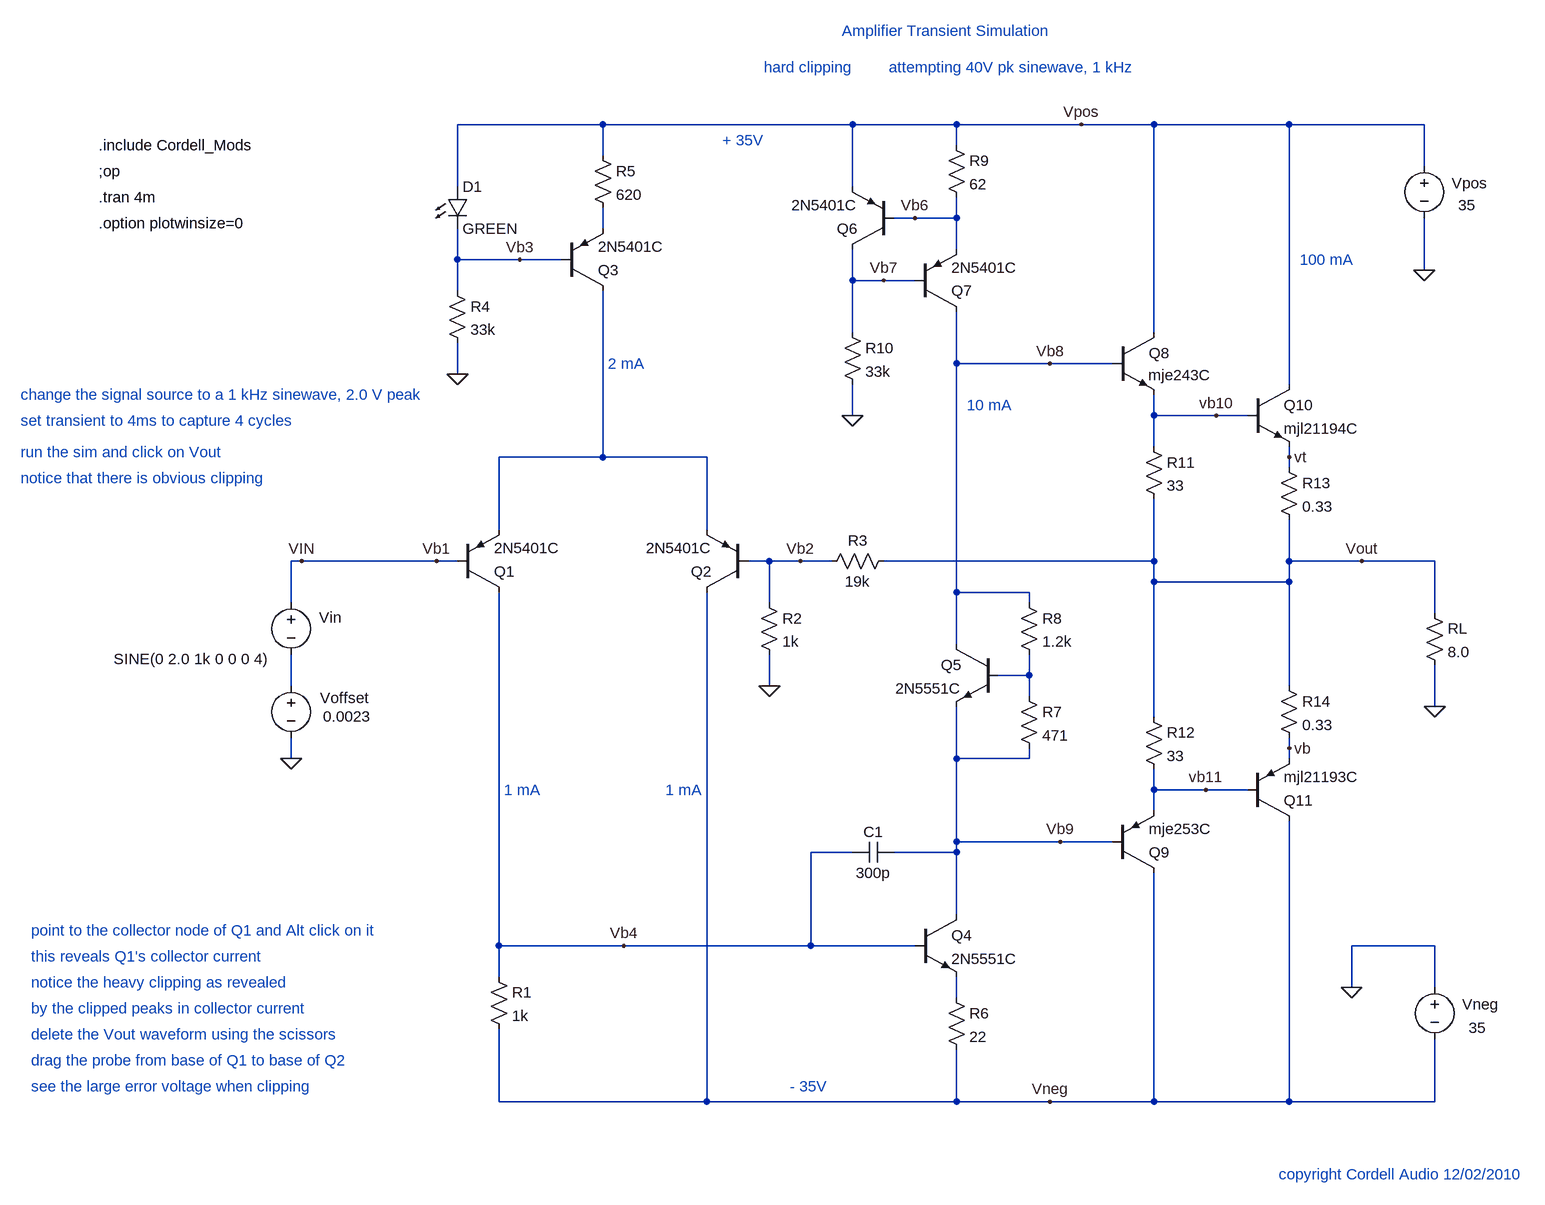
[diagram p0: schematic Amplifier Transient 1k clip plus.asc]
Amplifier Transient 1k clip plus.asc, the LTspice schematic file:
Version 4
SHEET 1 2428 1408
WIRE -128 -224 -352 -224
WIRE 256 -224 -128 -224
WIRE 416 -224 256 -224
WIRE 608 -224 416 -224
WIRE 720 -224 608 -224
WIRE 928 -224 720 -224
WIRE 1136 -224 928 -224
WIRE 416 -192 416 -224
WIRE -128 -176 -128 -224
WIRE 1136 -160 1136 -224
WIRE -352 -128 -352 -224
WIRE 256 -128 256 -224
WIRE 352 -80 320 -80
WIRE 416 -80 416 -112
WIRE 416 -80 352 -80
WIRE -128 -64 -128 -96
WIRE 416 -32 416 -80
WIRE -352 -16 -352 -64
WIRE -256 -16 -352 -16
WIRE -192 -16 -256 -16
WIRE 1136 0 1136 -80
WIRE 256 16 256 -32
WIRE 304 16 256 16
WIRE 352 16 304 16
WIRE -352 32 -352 -16
WIRE 256 96 256 16
WIRE 720 96 720 -224
WIRE 416 144 416 64
WIRE 560 144 416 144
WIRE 656 144 560 144
WIRE -352 160 -352 112
WIRE 928 176 928 -224
WIRE 256 224 256 176
WIRE 720 224 720 192
WIRE 816 224 720 224
WIRE 864 224 816 224
WIRE 720 272 720 224
WIRE -128 288 -128 32
WIRE -128 288 -288 288
WIRE 32 288 -128 288
WIRE 928 288 928 272
WIRE 928 304 928 288
WIRE -288 400 -288 288
WIRE 32 400 32 288
WIRE -592 448 -608 448
WIRE -384 448 -592 448
WIRE -352 448 -384 448
WIRE 128 448 96 448
WIRE 176 448 128 448
WIRE 224 448 176 448
WIRE 720 448 720 352
WIRE 720 448 304 448
WIRE 928 448 928 384
WIRE 1040 448 928 448
WIRE 1152 448 1040 448
WIRE 720 480 720 448
WIRE 928 480 928 448
WIRE 928 480 720 480
WIRE 416 496 416 144
WIRE 528 496 416 496
WIRE -608 512 -608 448
WIRE 128 512 128 448
WIRE 528 512 528 496
WIRE 1152 528 1152 448
WIRE 416 576 416 496
WIRE 528 624 528 592
WIRE 528 624 480 624
WIRE -608 640 -608 592
WIRE 128 640 128 592
WIRE 928 640 928 480
WIRE 528 656 528 624
WIRE 1152 672 1152 608
WIRE 720 688 720 480
WIRE 928 736 928 720
WIRE -608 752 -608 720
WIRE 416 752 416 672
WIRE 528 752 528 736
WIRE 528 752 416 752
WIRE 928 752 928 736
WIRE 720 800 720 768
WIRE 800 800 720 800
WIRE 864 800 800 800
WIRE 720 832 720 800
WIRE 416 880 416 752
WIRE 576 880 416 880
WIRE 656 880 576 880
WIRE 256 896 192 896
WIRE 416 896 416 880
WIRE 416 896 320 896
WIRE 416 992 416 896
WIRE -288 1040 -288 496
WIRE -96 1040 -288 1040
WIRE 192 1040 192 896
WIRE 192 1040 -96 1040
WIRE 352 1040 192 1040
WIRE 1152 1040 1024 1040
WIRE -288 1088 -288 1040
WIRE 1024 1104 1024 1040
WIRE 1152 1104 1152 1040
WIRE 416 1120 416 1088
WIRE -288 1280 -288 1168
WIRE 32 1280 32 496
WIRE 32 1280 -288 1280
WIRE 416 1280 416 1200
WIRE 416 1280 32 1280
WIRE 560 1280 416 1280
WIRE 720 1280 720 928
WIRE 720 1280 560 1280
WIRE 928 1280 928 848
WIRE 928 1280 720 1280
WIRE 1152 1280 1152 1184
WIRE 1152 1280 928 1280
FLAG -608 752 0
FLAG -592 448 VIN
FLAG -352 160 0
FLAG 128 640 0
FLAG 1024 1104 0
FLAG 1136 0 0
FLAG 928 288 vt
FLAG 928 736 vb
FLAG 816 224 vb10
FLAG 800 800 vb11
FLAG 256 224 0
FLAG 1152 672 0
FLAG 560 144 Vb8
FLAG 576 880 Vb9
FLAG -384 448 Vb1
FLAG 176 448 Vb2
FLAG -256 -16 Vb3
FLAG -96 1040 Vb4
FLAG 352 -80 Vb6
FLAG 304 16 Vb7
FLAG 1040 448 Vout
FLAG 608 -224 Vpos
FLAG 560 1280 Vneg
SYMBOL pnp -192 32 M180
SYMATTR InstName Q3
SYMATTR Value 2N5401C
SYMBOL pnp 320 -32 R180
SYMATTR InstName Q6
SYMATTR Value 2N5401C
SYMBOL voltage -608 496 R0
WINDOW 123 42 73 Left 0
WINDOW 39 0 0 Left 0
WINDOW 3 -273 103 Left 0
WINDOW 0 43 39 Left 0
SYMATTR Value SINE(0 2.0 1k 0 0 0 4)
SYMATTR InstName Vin
SYMBOL cap 320 880 R90
WINDOW 0 0 32 VBottom 0
WINDOW 3 32 32 VTop 0
SYMATTR InstName C1
SYMATTR Value 300p
SYMBOL npn 352 992 R0
SYMATTR InstName Q4
SYMATTR Value 2N5551C
SYMBOL res 400 -208 R0
SYMATTR InstName R9
SYMATTR Value 62
SYMBOL pnp 352 64 M180
SYMATTR InstName Q7
SYMATTR Value 2N5401C
SYMBOL res 400 1104 R0
SYMATTR InstName R6
SYMATTR Value 22
SYMBOL res -304 1072 R0
SYMATTR InstName R1
SYMATTR Value 1k
SYMBOL pnp -352 496 M180
SYMATTR InstName Q1
SYMATTR Value 2N5401C
SYMBOL pnp 96 496 R180
SYMATTR InstName Q2
SYMATTR Value 2N5401C
SYMBOL res -144 -192 R0
SYMATTR InstName R5
SYMATTR Value 620
SYMBOL res -368 16 R0
SYMATTR InstName R4
SYMATTR Value 33k
SYMBOL voltage 1136 -176 R0
WINDOW 123 0 0 Left 0
WINDOW 39 0 0 Left 0
WINDOW 0 42 42 Left 0
WINDOW 3 52 76 Left 0
SYMATTR InstName Vpos
SYMATTR Value 35
SYMBOL res 320 432 R90
WINDOW 0 0 56 VBottom 0
WINDOW 3 32 56 VTop 0
SYMATTR InstName R3
SYMATTR Value 19k
SYMBOL voltage 1152 1088 R0
WINDOW 123 0 0 Left 0
WINDOW 39 0 0 Left 0
WINDOW 0 42 42 Left 0
WINDOW 3 52 78 Left 0
SYMATTR InstName Vneg
SYMATTR Value 35
SYMBOL res 112 496 R0
SYMATTR InstName R2
SYMATTR Value 1k
SYMBOL npn 656 96 R0
WINDOW 3 55 66 Left 0
SYMATTR Value mje243C
SYMATTR InstName Q8
SYMBOL pnp 656 928 M180
SYMATTR InstName Q9
SYMATTR Value mje253C
SYMBOL res 912 624 R0
SYMATTR InstName R14
SYMATTR Value 0.33
SYMBOL res 912 288 R0
SYMATTR InstName R13
SYMATTR Value 0.33
SYMBOL npn 864 176 R0
SYMATTR InstName Q10
SYMATTR Value mjl21194C
SYMBOL pnp 864 848 M180
SYMATTR InstName Q11
SYMATTR Value mjl21193C
SYMBOL res 704 672 R0
SYMATTR InstName R12
SYMATTR Value 33
SYMBOL LED -368 -128 R0
SYMATTR InstName D1
SYMATTR Value GREEN
SYMBOL res 240 80 R0
SYMATTR InstName R10
SYMATTR Value 33k
SYMBOL res 1136 512 R0
SYMATTR InstName RL
SYMATTR Value 8.0
SYMBOL res 704 256 R0
SYMATTR InstName R11
SYMATTR Value 33
SYMBOL voltage -608 624 R0
WINDOW 123 0 0 Left 0
WINDOW 39 0 0 Left 0
WINDOW 0 45 35 Left 0
WINDOW 3 49 63 Left 0
SYMATTR InstName Voffset
SYMATTR Value 0.0023
SYMBOL npn 480 576 M0
SYMATTR InstName Q5
SYMATTR Value 2N5551C
SYMBOL res 512 496 R0
SYMATTR InstName R8
SYMATTR Value 1.2k
SYMBOL res 512 640 R0
SYMATTR InstName R7
SYMATTR Value 471
TEXT -904 -152 Left 0 !;op
TEXT -120 144 Left 0 ;2 mA
TEXT -280 800 Left 0 ;1 mA
TEXT 432 208 Left 0 ;10 mA
TEXT 56 -200 Left 0 ;+ 35V
TEXT 160 1256 Left 0 ;- 35V
TEXT -32 800 Left 0 ;1 mA
TEXT -904 -112 Left 0 !.tran 4m
TEXT -904 -72 Left 0 !.option plotwinsize=0
TEXT 944 -16 Left 0 ;100 mA
TEXT 312 -312 Left 0 ;attempting 40V pk sinewave, 1 kHz
TEXT -1024 192 Left 0 ;change the signal source to a 1 kHz sinewave, 2.0 V peak
TEXT -1024 232 Left 0 ;set transient to 4ms to capture 4 cycles
TEXT -1024 280 Left 0 ;run the sim and click on Vout
TEXT -1008 1016 Left 0 ;point to the collector node of Q1 and Alt click on it
TEXT -1008 1056 Left 0 ;this reveals Q1's collector current
TEXT -1024 320 Left 0 ;notice that there is obvious clipping
TEXT -1008 1096 Left 0 ;notice the heavy clipping as revealed
TEXT -1008 1136 Left 0 ;by the clipped peaks in collector current
TEXT -1008 1216 Left 0 ;drag the probe from base of Q1 to base of Q2
TEXT 120 -312 Left 0 ;hard clipping
TEXT -1008 1256 Left 0 ;see the large error voltage when clipping
TEXT -1008 1176 Left 0 ;delete the Vout waveform using the scissors
TEXT 912 1392 Left 0 ;copyright Cordell Audio 12/02/2010
TEXT 240 -368 Left 0 ;Amplifier Transient Simulation
TEXT -904 -192 Left 0 !.include Cordell_Mods

The netlist it stands for:
* Amplifier Transient 1k clip plus.asc
Q3 N002 Vb3 N001 0 2N5401C
Q6 Vb7 Vb6 Vpos 0 2N5401C
Vin Vb1 N004 SINE(0 2.0 1k 0 0 0 4)
C1 Vb9 Vb4 300p
Q4 Vb9 Vb4 N005 0 2N5551C
R9 Vpos Vb6 62
Q7 Vb8 Vb7 Vb6 0 2N5401C
R6 N005 Vneg 22
R1 Vb4 Vneg 1k
Q1 Vb4 Vb1 N002 0 2N5401C
Q2 Vneg Vb2 N002 0 2N5401C
R5 Vpos N001 620
R4 Vb3 0 33k
Vpos Vpos 0 35
R3 Vout Vb2 19k
Vneg 0 Vneg 35
R2 Vb2 0 1k
Q8 Vpos Vb8 vb10 0 mje243C
Q9 Vneg Vb9 vb11 0 mje253C
R14 Vout vb 0.33
R13 vt Vout 0.33
Q10 Vpos vb10 vt 0 mjl21194C
Q11 Vneg vb11 vb 0 mjl21193C
R12 Vout vb11 33
D1 Vpos Vb3 GREEN
R10 Vb7 0 33k
RL Vout 0 8.0
R11 vb10 Vout 33
Voffset N004 0 0.0023
Q5 Vb8 N003 Vb9 0 2N5551C
R8 Vb8 N003 1.2k
R7 N003 Vb9 471
.model D D
.lib standard.dio
.model NPN NPN
.model PNP PNP
.lib standard.bjt
;op
* 2 mA
* 1 mA
* 10 mA
* + 35V
* - 35V
* 1 mA
.tran 4m
.option plotwinsize=0
* 100 mA
* attempting 40V pk sinewave, 1 kHz
* change the signal source to a 1 kHz sinewave, 2.0 V peak
* set transient to 4ms to capture 4 cycles
* run the sim and click on Vout
* point to the collector node of Q1 and Alt click on it
* this reveals Q1's collector current
* notice that there is obvious clipping
* notice the heavy clipping as revealed
* by the clipped peaks in collector current
* drag the probe from base of Q1 to base of Q2
* hard clipping
* see the large error voltage when clipping
* delete the Vout waveform using the scissors
* copyright Cordell Audio 12/02/2010
* Amplifier Transient Simulation
.include Cordell_Mods
.backanno
.end